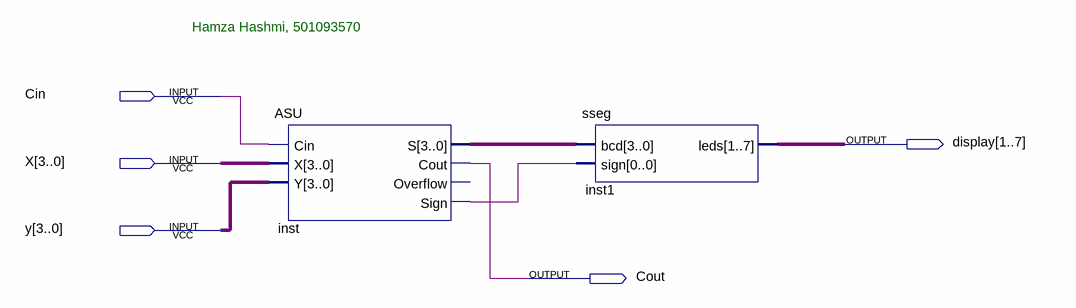
[diagram p0: schematic sheet]
// Quartus schematic CombinedASU1.bdf as structural Verilog: 2 symbols, 5 pins
module CombinedASU1 (
  input  Cin,
  input  [3:0] X,
  input  [3:0] y,
  output [1:7] display,
  output Cout
);

  wire inst_sign;
  wire [3:0] inst_s;

  ASU inst (.Cin(Cin), .X(X), .Y(y), .S(inst_s), .Cout(Cout), .Sign(inst_sign));  // open: Overflow
  sseg inst1 (.bcd(inst_s), .sign(inst_sign), .leds(display));

  // Notes on the sheet:
  //   Hamza Hashmi, 501093570
endmodule
